# EasyEDA schematic SCH_Well-Pump-Protection-Controller_2025-12-15.json
TITLE: Схема защиты насоса от протечек; REV: 1.0; Date: 2025-12-08; Sheet: 1/1; Drawn By: sbiletnikov; Company: Sergei Biletnikov
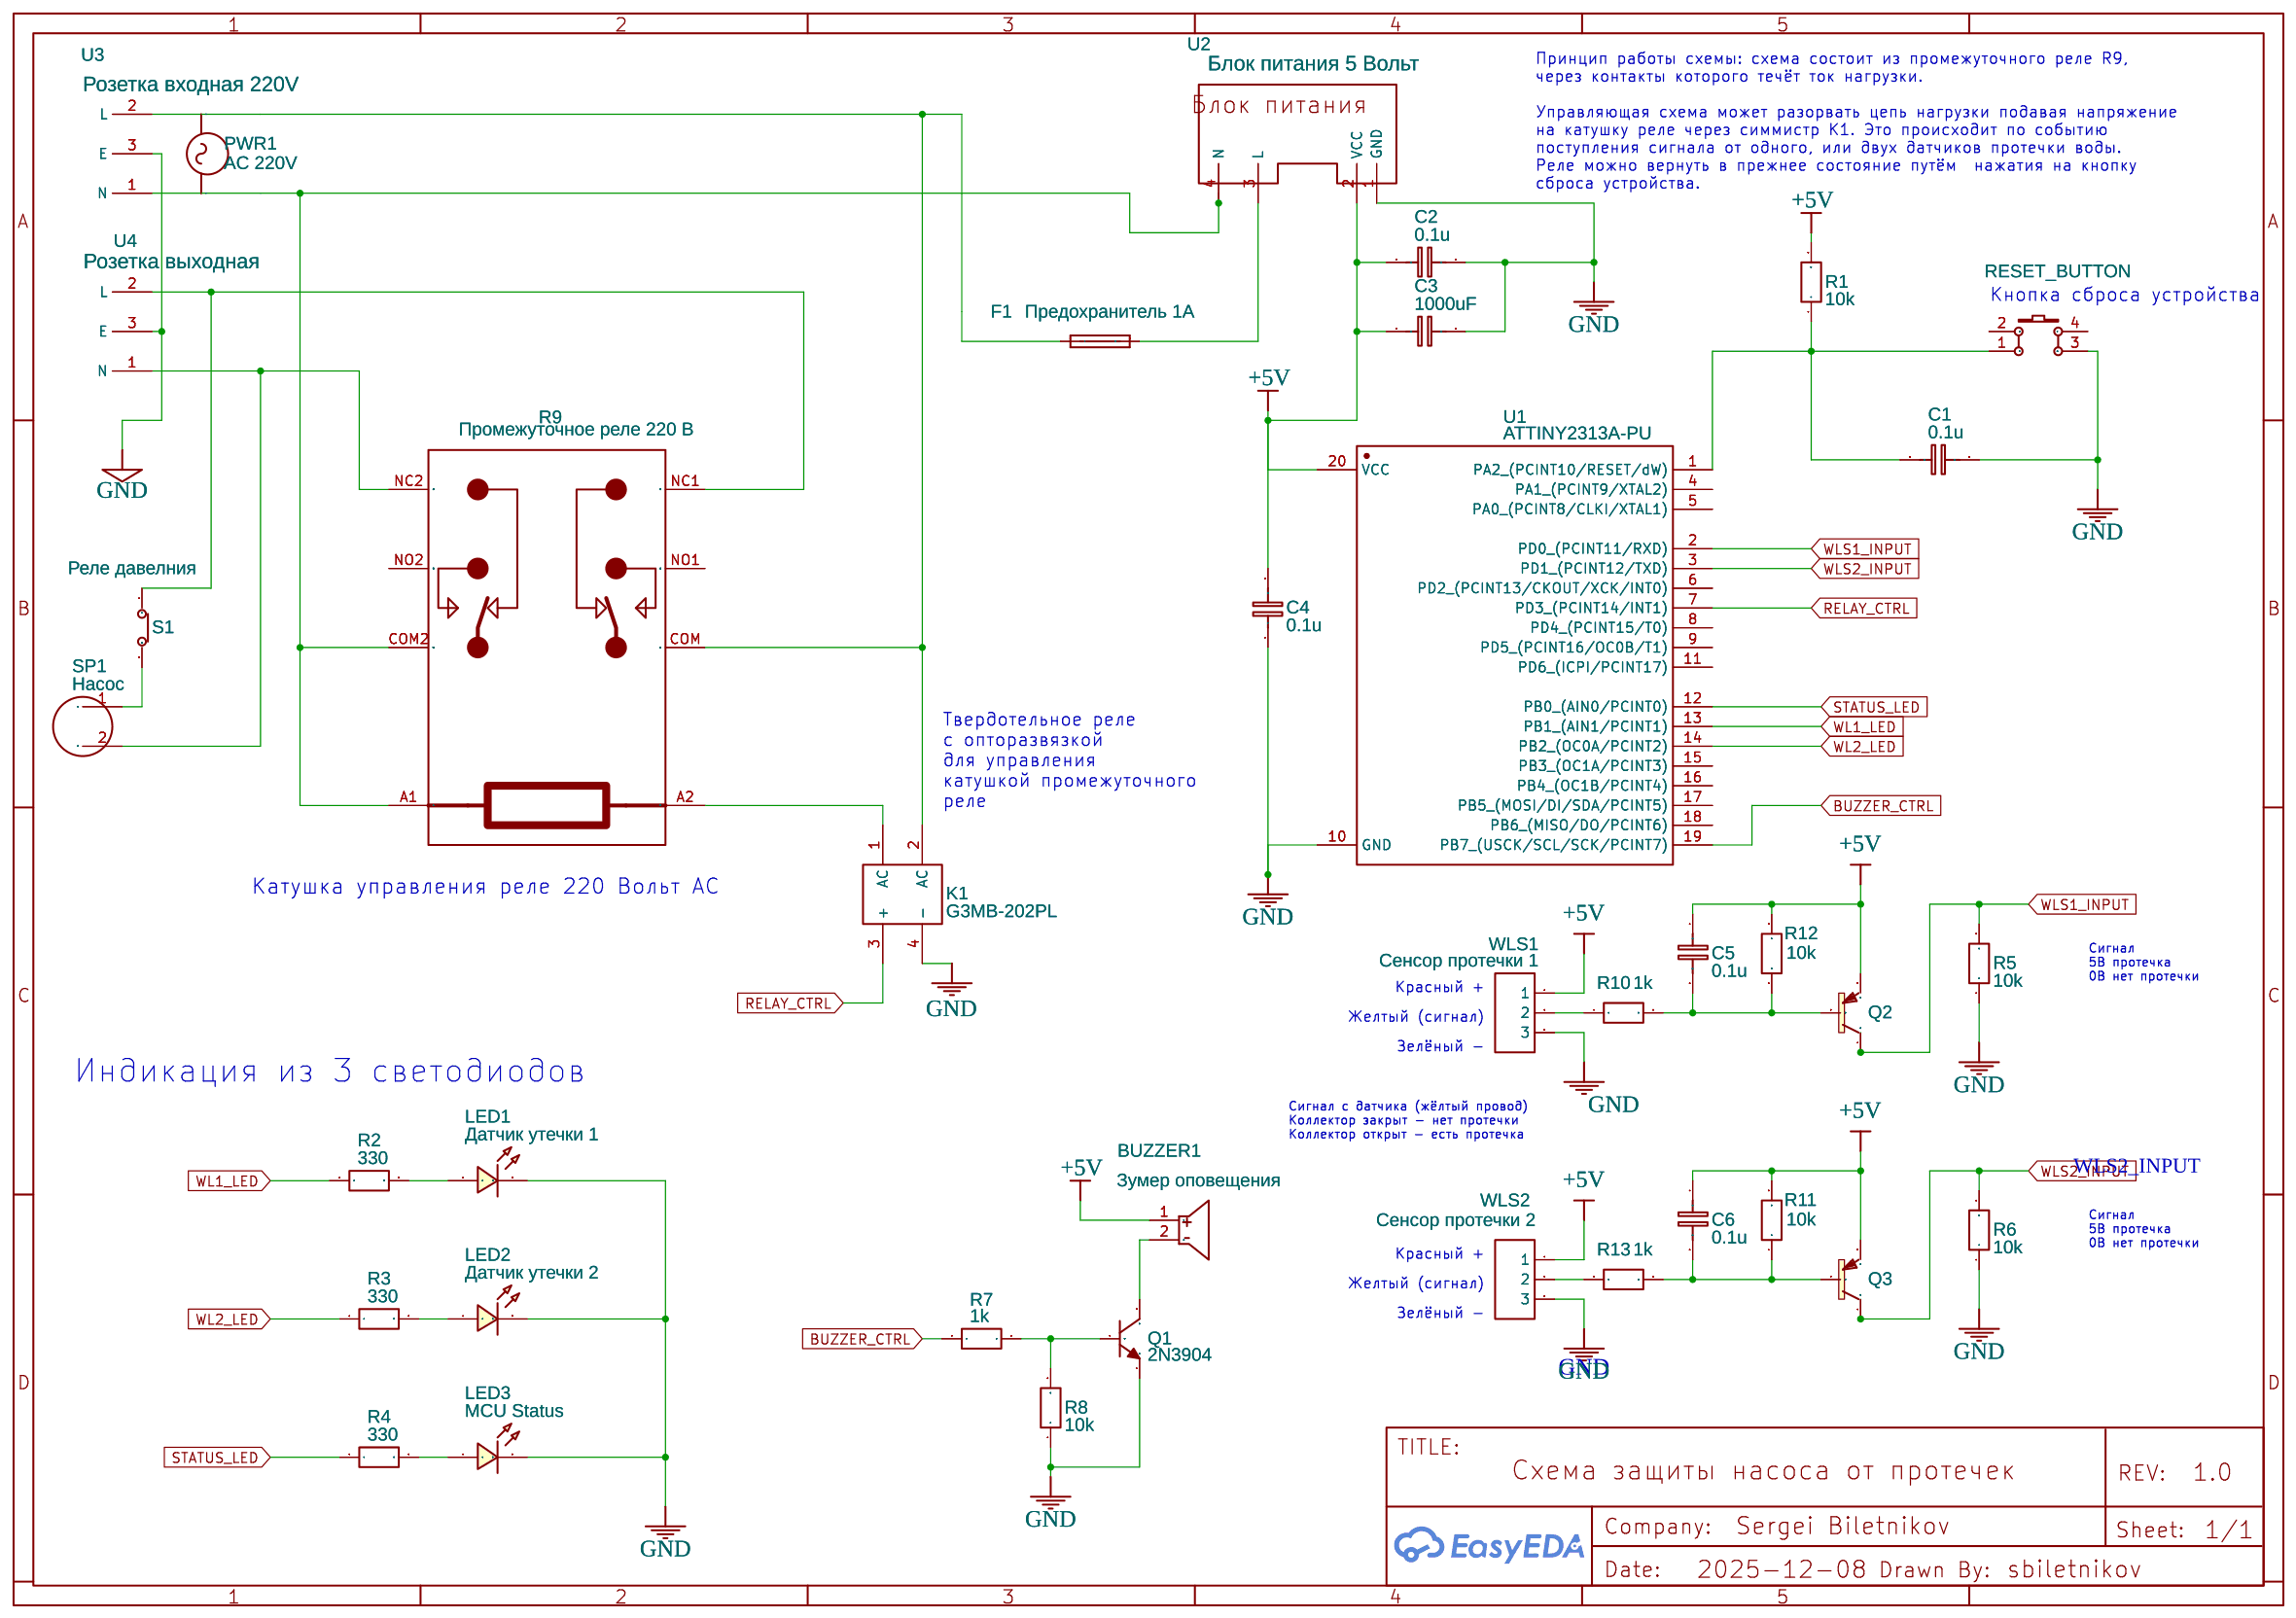
[diagram p0: schematic sheet]

## Parts
BUZZER1  Зумер оповещения  [BUZ-TH_BD12.0-P7.60-D0.6-FD]
C1  0.1u  [C0603]
C2  0.1u  [C0603]
C3  1000uF  [C0603]
C4  0.1u  [C0603]
C5  0.1u  [C0603]
C6  0.1u  [C0603]
F1  Предохранитель 1А  [FUSE-LITTLEFUSE]
K1  G3MB-202PL  [RELAY-TH_G3MB-202PL]
LED1  Датчик утечки 1  [LED-TH_BD3.0_RED]
LED2  Датчик утечки 2  [LED-TH_BD3.0_RED]
LED3  MCU Status  [LED-TH_BD3.0_GREEN]
PWR1  AC 220V
Q1  2N3904  [TO-92-3_L4.8-W3.7-P1.27-L]
Q2  2N3906PNP  [2N3906PNP]
Q3  2N3906PNP  [2N3906PNP]
R1  10k  [R0603]
R2  330  [R0603]
R3  330  [R0603]
R4  330  [R0603]
R5  10k  [R0603]
R6  10k  [R0603]
R7  1k  [R0603]
R8  10k  [R0603]
R9  Промежуточное реле 220 В  [RELAY 220V - 4 SCAMBI]
R10  1k  [R0603]
R11  10k  [R0603]
R12  10k  [R0603]
R13  1k  [R0603]
RESET_BUTTON  K4-6×6_TH  [KEY-TH_4P-L6.0-W6.0-P4.50-LS6.5]
S1  Реле давелния  [DIP SWITCH 6 SWITCHES]
SP1  Насос  [PUMP BUZZ]
U1  ATTINY2313A-PU  [DIP-20_L26.8-W6.4-P2.54-LS7.6-BL]
U2  Блок питания 5 Вольт  [POWERSUPPLY-5V]
U3  Розетка входная 220V  [POWER SOCKET]
U4  Розетка выходная  [POWER SOCKET]
WLS1  Сенсор протечки 1  [HDR-F-2.54_1X3]
WLS2  Сенсор протечки 2  [HDR-F-2.54_1X3]

## Library data of the parts
BUZZER1 = FMQ-BUZZER2: Contributor: LCSC; Supplier: LCSC; Supplier Part: C9900006103; JLCPCB Part Class: Extended Part; Manufacturer: null
C1-C6 = C_0603_EU: Contributor: LCEDA_Lib
F1 = FUSE_TERM: Contributor: Claude Detier
K1 = G3MB-202PL: Supplier: LCSC; Manufacturer: OMRON(欧姆龙); Supplier Part: C48654; JLCPCB Part Class: Extended Part
LED1 LED2 = LED-TH-3mm_R: Manufacturer: EVERLIGHT(台湾亿光); Manufacturer Part: 204-10SDRD/S530-A3-L; Supplier Part: C84774; Supplier: LCSC; Contributor: LCEDA_Lib
LED3 = LED-TH-3mm_G: Manufacturer: EVERLIGHT(台湾亿光); Manufacturer Part: 204-10SYGD/S530-E3; Supplier Part: C85161; Contributor: LCEDA_Lib
PWR1 = AC: Contributor: spiel81
Q1 = 2N3904-338: Supplier: LCSC; Supplier Part: C22751478; Manufacturer: ALJ(龙晶微); Contributor: lcsc; JLCPCB Part Class: Extended Part
Q2 Q3 = 2N3906PNP: Contributor: boonchuan khongsupsinsiri
R1-R8 R10-R13 = R_0603_EU: Contributor: LCEDA_Lib
R9 = RELAY 220V AC COIL: Contributor: Sutee.S
RESET_BUTTON = K4-6×6_TH: Supplier: LCSC; Supplier Part: C136684; Manufacturer: 韩国韩荣; Manufacturer Part: K2-1102DP-E4SW-04; Contributor: LCEDA_Lib
S1 = switch1: Manufacturer: DIP; Manufacturer Part: DIP switchEI-08; Supplier Part: C90019; Contributor: Hua-Chih Shih; libConvert: Yes; Add into BOM: Yes
SP1 = Pump buzz: Contributor: listkena
U1 = ATTINY2313A-PU: Supplier: LCSC; Manufacturer: MICROCHIP(美国微芯); Supplier Part: C112165; JLCPCB Part Class: Extended Part
U2 = PowerSupply-5v: Manufacturer Part: PS-5V; Contributor: ac.tanu; Supplier Part: 1; Supplier: MyPart
U3 U4 = Power Socket: Manufacturer Part: IEC 320-C14; Contributor: GijsClement
WLS1 WLS2 = HDR-F-2.54_1x3: Supplier Part: C146690; Supplier: LCSC; Contributor: LCEDA_Lib

## Nets
+5V: BUZZER1.1 C2.1 C3.1 C4.2 C5.1 C6.1 Q2.3(E) Q3.3(E) R1.2 R11.2 R12.2 U1.20(VCC) U2.2(VCC) WLS1.1 WLS2.1
GND: C1.2 C2.2 C3.2 C4.1 K1.4(-) LED1.2 LED2.2 LED3.2 Q1.1(E) R5.1 R6.1 R8.1 RESET_BUTTON.3 U1.10(GND) U2.1(GND) U3.3(E) U4.3(E) WLS1.3 WLS2.3
BUZZER_CTRL: R7.1 U1.19(PB7 (USCK/SCL/SCK/PCINT7))
RELAY_CTRL: K1.3(+) U1.7(PD3 (PCINT14/INT1))
STATUS_LED: R4.1 U1.12(PB0 (AIN0/PCINT0))
WL1_LED: R2.1 U1.13(PB1 (AIN1/PCINT1))
WL2_LED: R3.1 U1.14(PB2 (OC0A/PCINT2))
WLS1_INPUT: Q2.1(C) R5.2 U1.2(PD0 (PCINT11/RXD))
WLS2_INPUT: Q3.1(C) R6.2 U1.3(PD1 (PCINT12/TXD))
Net-(BUZZER1-2): BUZZER1.2 Q1.3(C)
Net-(C1-1): C1.1 R1.1 RESET_BUTTON.1 U1.1(PA2 (PCINT10/RESET/dW))
Net-(C5-2): C5.2 Q2.2(B) R10.2 R12.1
Net-(C6-2): C6.2 Q3.2(B) R11.1 R13.2
Net-(F1-1): F1.1 K1.2(AC) R9.COM U3.2(L)
Net-(F1-2): F1.2 U2.3(L)
Net-(K1-1): K1.1(AC) R9.A2(13)
Net-(LED1-1): LED1.1 R2.2
Net-(LED2-1): LED2.1 R3.2
Net-(LED3-1): LED3.1 R4.2
Net-(Q1-2): Q1.2(B) R7.2 R8.2
Net-(R9-A1): R9.A1(14) R9.COM2 U2.4(N) U3.1(N)
Net-(R9-NC1): R9.NC1 S1.4 U4.2(L)
Net-(R9-NC2): R9.NC2(NO2) SP1.2 U4.1(N)
Net-(R10-1): R10.1 WLS1.2
Net-(R13-1): R13.1 WLS2.2
Net-(S1-3): S1.3 SP1.1

Not connected (* = marked no-connect by the designer): PWR1 + -; R9 NO1 NO2; RESET_BUTTON 2 4; U1 4(PA1 (PCINT9/XTAL2)) 5(PA0 (PCINT8/CLKI/XTAL1)) 6(PD2 (PCINT13/CKOUT/XCK/INT0)) 8(PD4 (PCINT15/T0)) 9(PD5 (PCINT16/OC0B/T1)) 11(PD6 (ICPI/PCINT17)) 15(PB3 (OC1A/PCINT3)) 16(PB4 (OC1B/PCINT4)) 17(PB5 (MOSI/DI/SDA/PCINT5)) 18(PB6 (MISO/DO/PCINT6))

## Notes on the sheet
- Принцип работы схемы: схема состоит из промежуточного реле R9,
  через контакты которого течёт ток нагрузки.
  Управляющая схема может разорвать цепь нагрузки подавая напряжение
  на катушку реле через симмистр K1. Это происходит по событию
  поступления сигнала от одного, или двух датчиков протечки воды.
  Реле можно вернуть в прежнее состояние путём  нажатия на кнопку
  сброса устройства.
- Кнопка сброса устройства
- Твердотельное реле
  с опторазвязкой
  для управления
  катушкой промежуточного
  реле
- Катушка управления реле 220 Вольт AC
- Сигнал
  5В протечка
  0В нет протечки
- Красный +
- Желтый (сигнал)
- Зелёный -
- Индикация из 3 светодиодов
- Сигнал с датчика (жёлтый провод)
  Коллектор закрыт - нет протечки
  Коллектор открыт - есть протечка
- WLS2_INPUT
- Сигнал
  5В протечка
  0В нет протечки
- Красный +
- Желтый (сигнал)
- Зелёный -
- GND
